# EAGLE schematic poiduino7 (EAGLE 9.0.0)
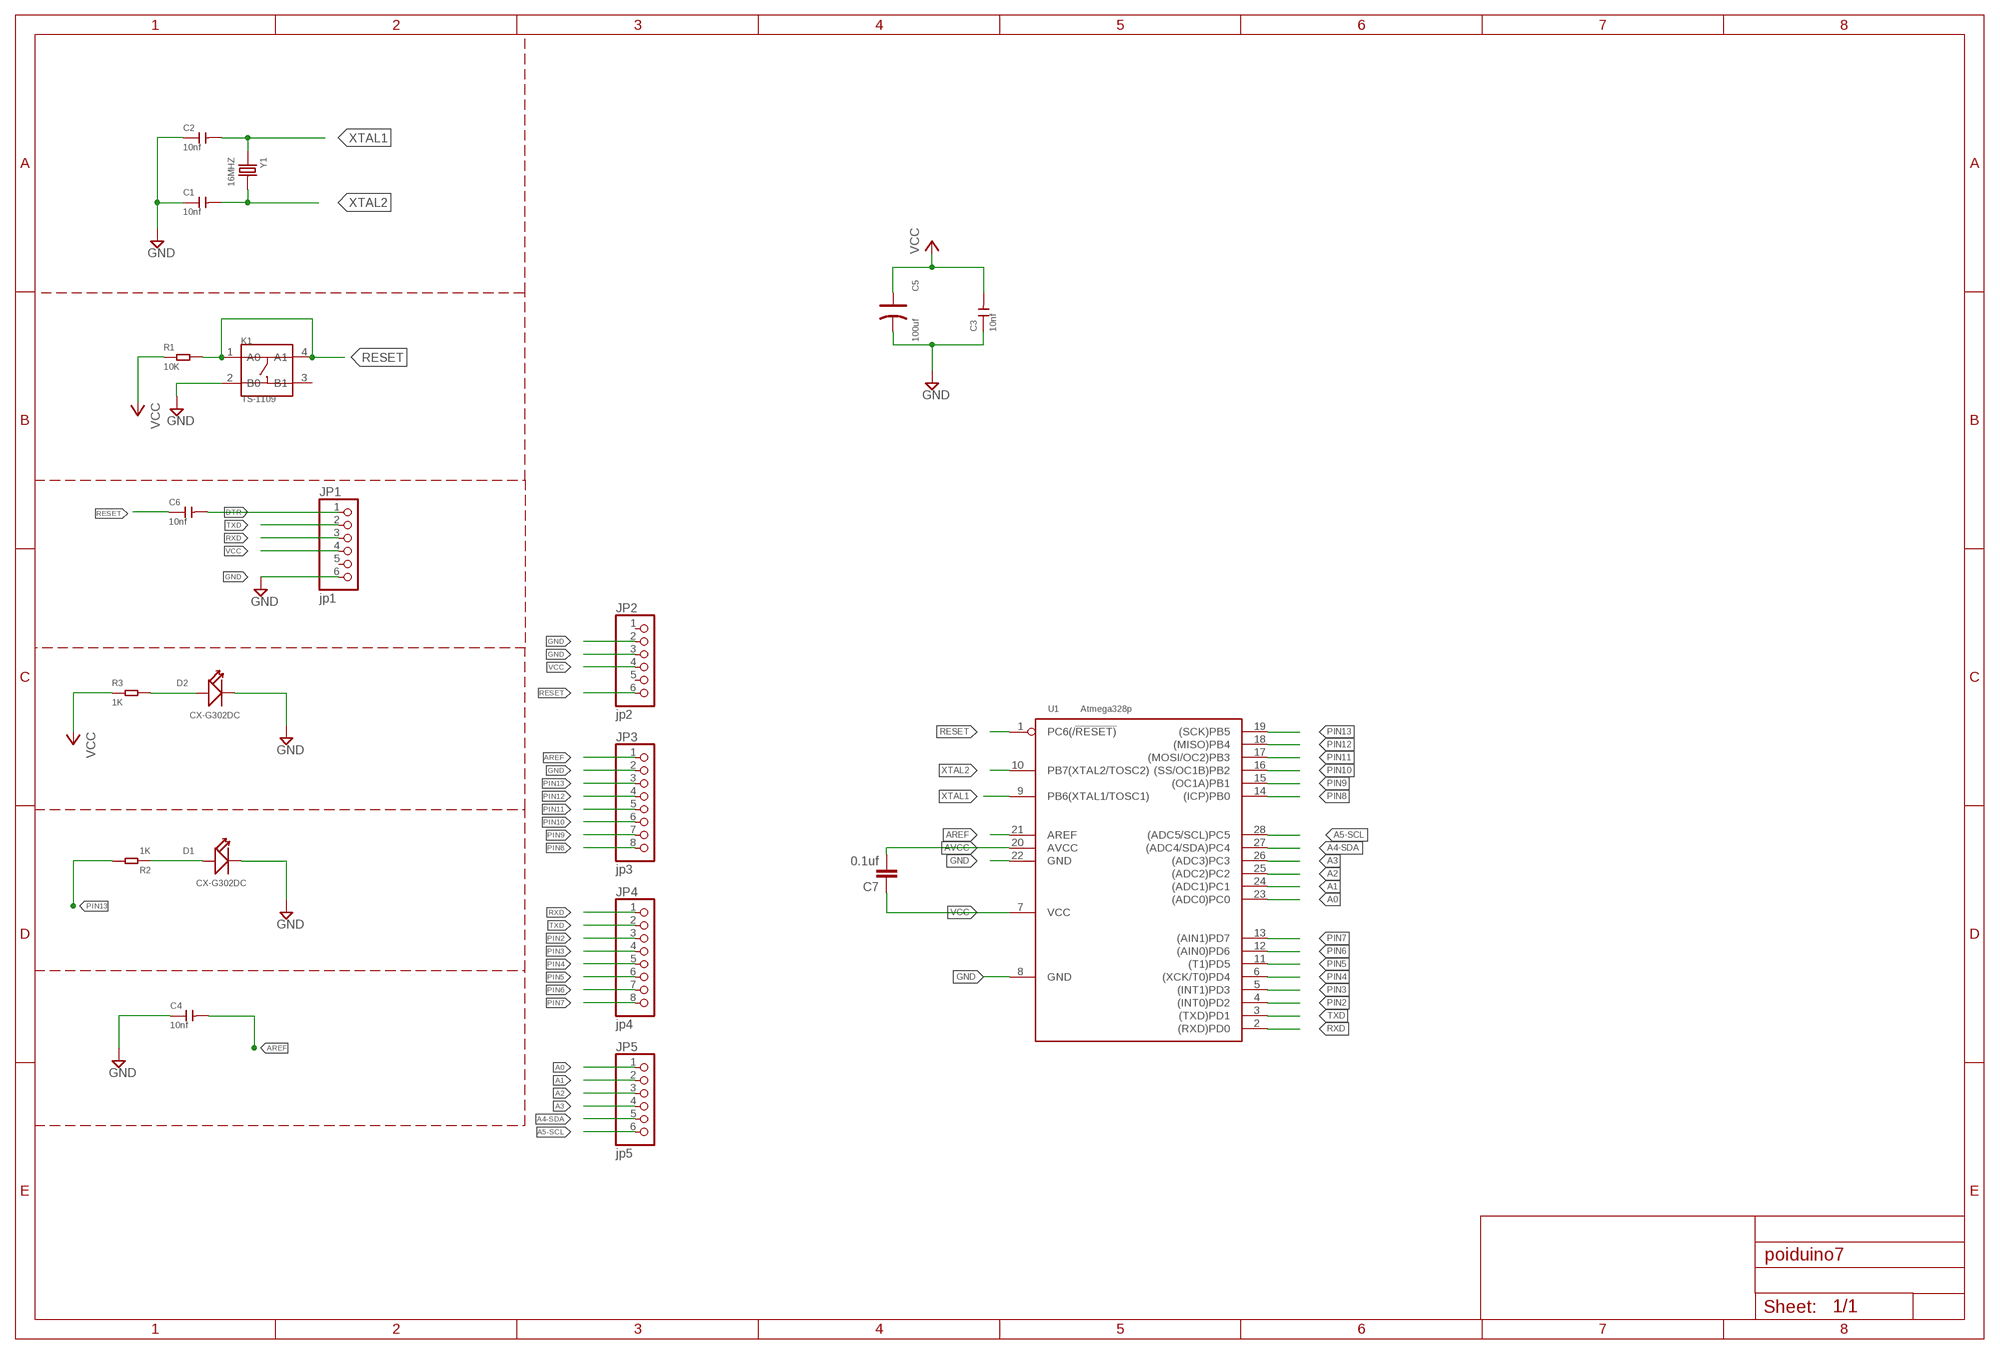
[diagram p0: schematic, sheet 1]

## Parts
C1  10nf  DIP-CERAMIC-DISC-10NF-50V-Y5V(D4.0MM)  [CERAMIC-2.54]
C2  10nf  DIP-CERAMIC-DISC-10NF-50V-Y5V(D4.0MM)  [CERAMIC-2.54]
C3  10nf  DIP-CERAMIC-DISC-10NF-50V-Y5V(D4.0MM)  [CERAMIC-2.54]
C4  10nf  DIP-CERAMIC-DISC-10NF-50V-Y5V(D4.0MM)  [CERAMIC-2.54]
C5  100uf  DIP-ALUMINUM-47UF-16V(D5-H7MM)  [PC-D5.3MM]
C6  10nf  DIP-CERAMIC-DISC-10NF-50V-Y5V(D4.0MM)  [CERAMIC-2.54]
C7  0.1uf  C5/2.5  [C5B2.5]
D1  CX-G302DC  DIP-LED-GREEN-GREEN(2P-D3MM)  [LED2-2.54-D3.0MM]
D2  CX-G302DC  DIP-LED-GREEN-GREEN(2P-D3MM)  [LED2-2.54-D3.0MM]
JP1  jp1  PINHD-1X6  [1X06]
JP2  jp2  PINHD-1X6  [1X06]
JP3  jp3  PINHD-1X8  [1X08]
JP4  jp4  PINHD-1X8  [1X08]
JP5  jp5  PINHD-1X6  [1X06]
K1  TS-1109  DIP-BUTTON-4P  [SW4-6.0X6.0X5.0MM]
R1  10K  DIP-RES-10K-5%-1/4W(PR-D2.3XL6.5MM)  [PR-D2.3XL6.5MM]
R2  1K  DIP-RES-1K-5%-1/4W(PR-D2.3XL6.5MM)  [PR-D2.3XL6.5MM]
R3  1K  DIP-RES-1K-5%-1/4W(PR-D2.3XL6.5MM)  [PR-D2.3XL6.5MM]
U1  Atmega328p  MCU-ATMEGA328P-PU(DIP28)  [DIP28-2.54-34.7X7.62MM]
Y1  16MHZ  DIP-CRYSTAL-16MHZ-18PF-30PPM-40R(HC49US)  [HC49US]

## Nets
A0: JP5.1 U1.23((ADC0)PC0)
A1: JP5.2 U1.24((ADC1)PC1)
A2: JP5.3 U1.25((ADC2)PC2)
A3: JP5.4 U1.26((ADC3)PC3)
A4-SDA: JP5.5 U1.27((ADC4/SDA)PC4)
A5-SCL: JP5.6 U1.28((ADC5/SCL)PC5)
AREF: C4.2 JP3.1 U1.21(AREF)
AVCC: C7.2 U1.20(AVCC)
DTR: C6.2 JP1.1
GND: C1.1 C2.1 C3.1 C4.1 C5.- D1.K(-) D2.K(-) JP1.6 JP2.2 JP2.3 JP3.2 K1.2(B0) U1.8(GND) U1.22(GND)
N$3: D2.A(+) R3.2
N$6: D1.A(+) R2.1
PIN2: JP4.3 U1.4((INT0)PD2)
PIN3: JP4.4 U1.5((INT1)PD3)
PIN4: JP4.5 U1.6((XCK/T0)PD4)
PIN5: JP4.6 U1.11((T1)PD5)
PIN6: JP4.7 U1.12((AIN0)PD6)
PIN7: JP4.8 U1.13((AIN1)PD7)
PIN8: JP3.8 U1.14((ICP)PB0)
PIN9: JP3.7 U1.15((OC1A)PB1)
PIN10: JP3.6 U1.16((SS/OC1B)PB2)
PIN11: JP3.5 U1.17((MOSI/OC2)PB3)
PIN12: JP3.4 U1.18((MISO)PB4)
PIN13: JP3.3 R2.2 U1.19((SCK)PB5)
RESET: C6.1 JP2.6 K1.1(A0) K1.4(A1) R1.2 U1.1(PC6(/!RESET))
RXD: JP1.3 JP4.1 U1.2((RXD)PD0)
TXD: JP1.2 JP4.2 U1.3((TXD)PD1)
VCC: C3.2 C5.+ C7.1 JP1.4 JP2.4 R1.1 R3.1 U1.7(VCC)
XTAL1: C2.2 U1.9(PB6(XTAL1/TOSC1)) Y1.1
XTAL2: C1.2 U1.10(PB7(XTAL2/TOSC2)) Y1.2
Unconnected: JP1.5 JP2.1 JP2.5 K1.3(B1)

## Library data of the parts
C1-C4 C6 = Seeed-Capacitor:DIP-CERAMIC-DISC-10NF-50V-Y5V(D4.0MM): 302010202
C5 = Seeed-Capacitor:DIP-ALUMINUM-47UF-16V(D5-H7MM): 302030033; MPN: KS 100uF/16V
C7 = capacitor-wima:C: CAPACITOR naming: grid - package width
D1 D2 = Seeed-LED:DIP-LED-GREEN-GREEN(2P-D3MM): 304090040; MPN: CX-G302DC
JP1 JP2 JP5 = pinhead:PINHD-1X6: PIN HEADER
JP3 JP4 = pinhead:PINHD-1X8: PIN HEADER
K1 = Seeed-OPL-Button:DIP-BUTTON-4P: 311020024; MPN: TS-1109
R1 = Seeed-Resistor:DIP-RES-10K-5%-1/4W(PR-D2.3XL6.5MM): 301020001; MPN: FHCFR-1/4W-103J
R2 R3 = Seeed-Resistor:DIP-RES-1K-5%-1/4W(PR-D2.3XL6.5MM): 301020000; MPN: FHCFR-1/4W-102J
U1 = Seeed-IC:MCU-ATMEGA328P-PU(DIP28): 310010051; MPN: ATMEGA328P-PU
Y1 = Seeed-Crystal Oscillator:DIP-CRYSTAL-16MHZ-18PF-30PPM-40R(HC49US): 306010014; MPN: HC-49US 16.000MHz